# EAGLE schematic rfid (EAGLE 6.1)
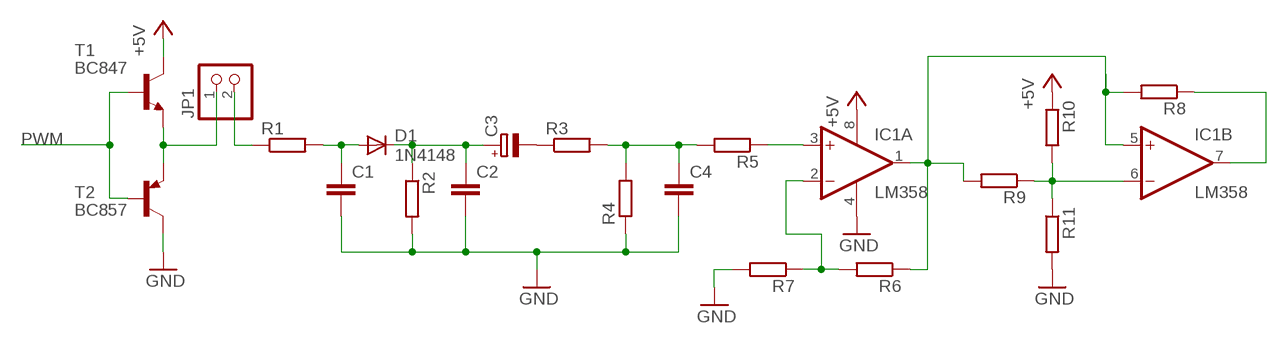
[diagram p0: schematic, sheet 1]

## Parts
C1  C-EUC0805K  [C0805K]
C2  C-EUC0805K  [C0805K]
C3  CPOL-EU  [SMC_A]
C4  C-EUC0805K  [C0805K]
D1  1N4148  [D0805]
IC1  LM358  [SO08]
JP1  PINHD-1X2  [1X02]
R1  R-EU_R0805  [R0805]
R2  R-EU_R0805  [R0805]
R3  R-EU_R0805  [R0805]
R4  R-EU_R0805  [R0805]
R5  R-EU_R0805  [R0805]
R6  R-EU_R0805  [R0805]
R7  R-EU_R0805  [R0805]
R8  R-EU_R0805  [R0805]
R9  R-EU_R0805  [R0805]
R10  R-EU_R0805  [R0805]
R11  R-EU_R0805  [R0805]
T1  BC847  [SOT23]
T2  BC857  [SOT23-BEC]

## Nets
+5V: IC1.8(P:V+) R10.1 T1.3(C)
GND: C1.2 C2.2 C4.2 IC1.4(P:V-) R2.2 R4.1 R7.2 R11.2 T2.C
N$1: JP1.1 T1.2(E) T2.E
N$2: JP1.2 R1.1
N$3: C1.1 D1.A R1.2
N$4: C2.1 C3.+ D1.C R2.1
N$5: C3.- R3.1
N$6: C4.1 R3.2 R4.2 R5.2
N$7: IC1.3(A:+IN) R5.1
N$8: IC1.1(A:OUT) IC1.5(B:+IN) R6.1 R8.2 R9.2
N$9: IC1.2(A:-IN) R6.2 R7.1
N$12: IC1.7(B:OUT) R8.1
N$13: IC1.6(B:-IN) R9.1 R10.2 R11.1
PWM: T1.1(B) T2.B

## Library data of the parts
C1 C2 C4 = rfid:C-EU: CAPACITOR, European symbol
C3 = rfid:CPOL-EU: POLARIZED CAPACITOR, European symbol
D1 = rfid:1N4148: DIODE high speed (Philips)
IC1 = rfid:LM358: OP AMP also LM158; LM258; LM2904 Source: http://cache.national.com/ds/LM/LM158.pdf
JP1 = rfid:PINHD-1X2: PIN HEADER
R1-R11 = rfid:R-EU_: RESISTOR, European symbol
T1 = rfid:BC847: NPN TRANSISTOR
T2 = rfid:BC857: PNP Transistror